# EAGLE design Motor Controller (EAGLE 8.6.0)
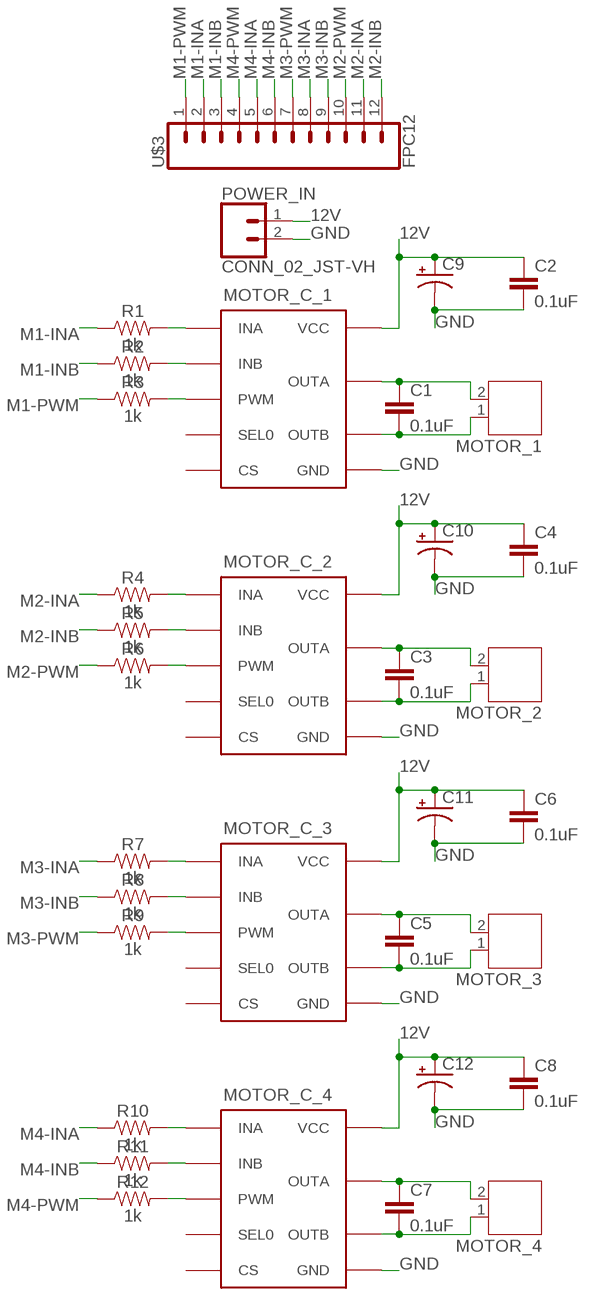
[diagram p0: schematic, sheet 1]

## Parts
C1  0.1uF  0.1UF-0603-25V-(+80/-20%)  [0603]
C2  0.1uF  0.1UF-0603-25V-(+80/-20%)  [0603]
C3  0.1uF  0.1UF-0603-25V-(+80/-20%)  [0603]
C4  0.1uF  0.1UF-0603-25V-(+80/-20%)  [0603]
C5  0.1uF  0.1UF-0603-25V-(+80/-20%)  [0603]
C6  0.1uF  0.1UF-0603-25V-(+80/-20%)  [0603]
C7  0.1uF  0.1UF-0603-25V-(+80/-20%)  [0603]
C8  0.1uF  0.1UF-0603-25V-(+80/-20%)  [0603]
C9  CPOL-USE3.5-8  [E3,5-8]
C10  CPOL-USE3.5-8  [E3,5-8]
C11  CPOL-USE3.5-8  [E3,5-8]
C12  CPOL-USE3.5-8  [E3,5-8]
MOTOR_1  JST-PH2  [JST-PH2]
MOTOR_2  JST-PH2  [JST-PH2]
MOTOR_3  JST-PH2  [JST-PH2]
MOTOR_4  JST-PH2  [JST-PH2]
MOTOR_C_1  VNH7100BASTR  [SO-16]
MOTOR_C_2  VNH7100BASTR  [SO-16]
MOTOR_C_3  VNH7100BASTR  [SO-16]
MOTOR_C_4  VNH7100BASTR  [SO-16]
POWER_IN  CONN_02_JST-VH  [B2P-VH]
R1  1k  1KOHM-0603-1/10W-1%  [0603]
R2  1k  1KOHM-0603-1/10W-1%  [0603]
R3  1k  1KOHM-0603-1/10W-1%  [0603]
R4  1k  1KOHM-0603-1/10W-1%  [0603]
R5  1k  1KOHM-0603-1/10W-1%  [0603]
R6  1k  1KOHM-0603-1/10W-1%  [0603]
R7  1k  1KOHM-0603-1/10W-1%  [0603]
R8  1k  1KOHM-0603-1/10W-1%  [0603]
R9  1k  1KOHM-0603-1/10W-1%  [0603]
R10  1k  1KOHM-0603-1/10W-1%  [0603]
R11  1k  1KOHM-0603-1/10W-1%  [0603]
R12  1k  1KOHM-0603-1/10W-1%  [0603]
U$3  FPC12  [FPC12]

## Nets
12V: C2.1 C4.1 C6.1 C8.1 C9.+ C10.+ C11.+ C12.+ MOTOR_C_1.4(VCC) MOTOR_C_1.5(VCC) MOTOR_C_1.12(VCC) MOTOR_C_2.4(VCC) MOTOR_C_2.5(VCC) MOTOR_C_2.12(VCC) MOTOR_C_3.4(VCC) MOTOR_C_3.5(VCC) MOTOR_C_3.12(VCC) MOTOR_C_4.4(VCC) MOTOR_C_4.5(VCC) MOTOR_C_4.12(VCC) POWER_IN.1
GND: C2.2 C4.2 C6.2 C8.2 C9.- C10.- C11.- C12.- MOTOR_C_1.1(GND) MOTOR_C_1.8(GND) MOTOR_C_1.9(GND) MOTOR_C_1.16(GND) MOTOR_C_2.1(GND) MOTOR_C_2.8(GND) MOTOR_C_2.9(GND) MOTOR_C_2.16(GND) MOTOR_C_3.1(GND) MOTOR_C_3.8(GND) MOTOR_C_3.9(GND) MOTOR_C_3.16(GND) MOTOR_C_4.1(GND) MOTOR_C_4.8(GND) MOTOR_C_4.9(GND) MOTOR_C_4.16(GND) POWER_IN.2
M1-INA: R1.1 U$3.2
M1-INB: R2.1 U$3.3
M1-PWM: R3.1 U$3.1
M2-INA: R4.1 U$3.11
M2-INB: R5.1 U$3.12
M2-PWM: R6.1 U$3.10
M3-INA: R7.1 U$3.8
M3-INB: R8.1 U$3.9
M3-PWM: R9.1 U$3.7
M4-INA: R10.1 U$3.5
M4-INB: R11.1 U$3.6
M4-PWM: R12.1 U$3.4
N$1: MOTOR_C_1.3(INA) R1.2
N$2: MOTOR_C_1.6(INB) R2.2
N$3: MOTOR_C_2.3(INA) R4.2
N$4: MOTOR_C_2.6(INB) R5.2
N$5: MOTOR_C_1.11(PWM) R3.2
N$6: MOTOR_C_2.11(PWM) R6.2
N$7: C3.1 MOTOR_2.2 MOTOR_C_2.2(OUTA) MOTOR_C_2.15(OUTA)
N$8: C1.1 MOTOR_1.2 MOTOR_C_1.2(OUTA) MOTOR_C_1.15(OUTA)
N$9: C1.2 MOTOR_1.1 MOTOR_C_1.7(OUTB) MOTOR_C_1.10(OUTB)
N$10: C3.2 MOTOR_2.1 MOTOR_C_2.7(OUTB) MOTOR_C_2.10(OUTB)
N$11: MOTOR_C_3.3(INA) R7.2
N$12: MOTOR_C_3.6(INB) R8.2
N$13: MOTOR_C_3.11(PWM) R9.2
N$14: C5.1 MOTOR_3.2 MOTOR_C_3.2(OUTA) MOTOR_C_3.15(OUTA)
N$15: C5.2 MOTOR_3.1 MOTOR_C_3.7(OUTB) MOTOR_C_3.10(OUTB)
N$16: MOTOR_C_4.3(INA) R10.2
N$17: MOTOR_C_4.6(INB) R11.2
N$18: MOTOR_C_4.11(PWM) R12.2
N$19: C7.1 MOTOR_4.2 MOTOR_C_4.2(OUTA) MOTOR_C_4.15(OUTA)
N$20: C7.2 MOTOR_4.1 MOTOR_C_4.7(OUTB) MOTOR_C_4.10(OUTB)
Unconnected: MOTOR_C_1.13(CS) MOTOR_C_1.14(SEL0) MOTOR_C_2.13(CS) MOTOR_C_2.14(SEL0) MOTOR_C_3.13(CS) MOTOR_C_3.14(SEL0) MOTOR_C_4.13(CS) MOTOR_C_4.14(SEL0)

## Library data of the parts
C1-C8 = SparkFun-Capacitors:0.1UF: 0.1µF ceramic capacitors A capacitor is a passive two-terminal electrical component used to store electrical energy temporarily in an electric field.; PROD_ID: CAP-00810
C9-C12 = adafruit:CPOL-US: POLARIZED CAPACITOR, American symbol
MOTOR_1-MOTOR_4 = jst-ph:JST-PH2
MOTOR_C_1-MOTOR_C_4 = VNH7100BASTR:VNH7100BASTR: VNH7100BASTR
POWER_IN = JST-VH:CONN_02_JST-VH: B2P-VH(LF)(SN) Digikey <https://www.digikey.com.au/product-detail/en/jst-sales-america-inc/B2P-VH-LF-SN/455-1639-ND/926547>
R1-R12 = SparkFun-Resistors:1KOHM: 1kΩ resistor A resistor is a passive two-terminal electrical component that implements electrical resistance as a circuit element. Resistors act to reduce current flow, and, at the same time, act to lower voltage levels within circuits. - Wikipedia; PROD_ID: RES-07856
U$3 = FFC:FPC12

## Board
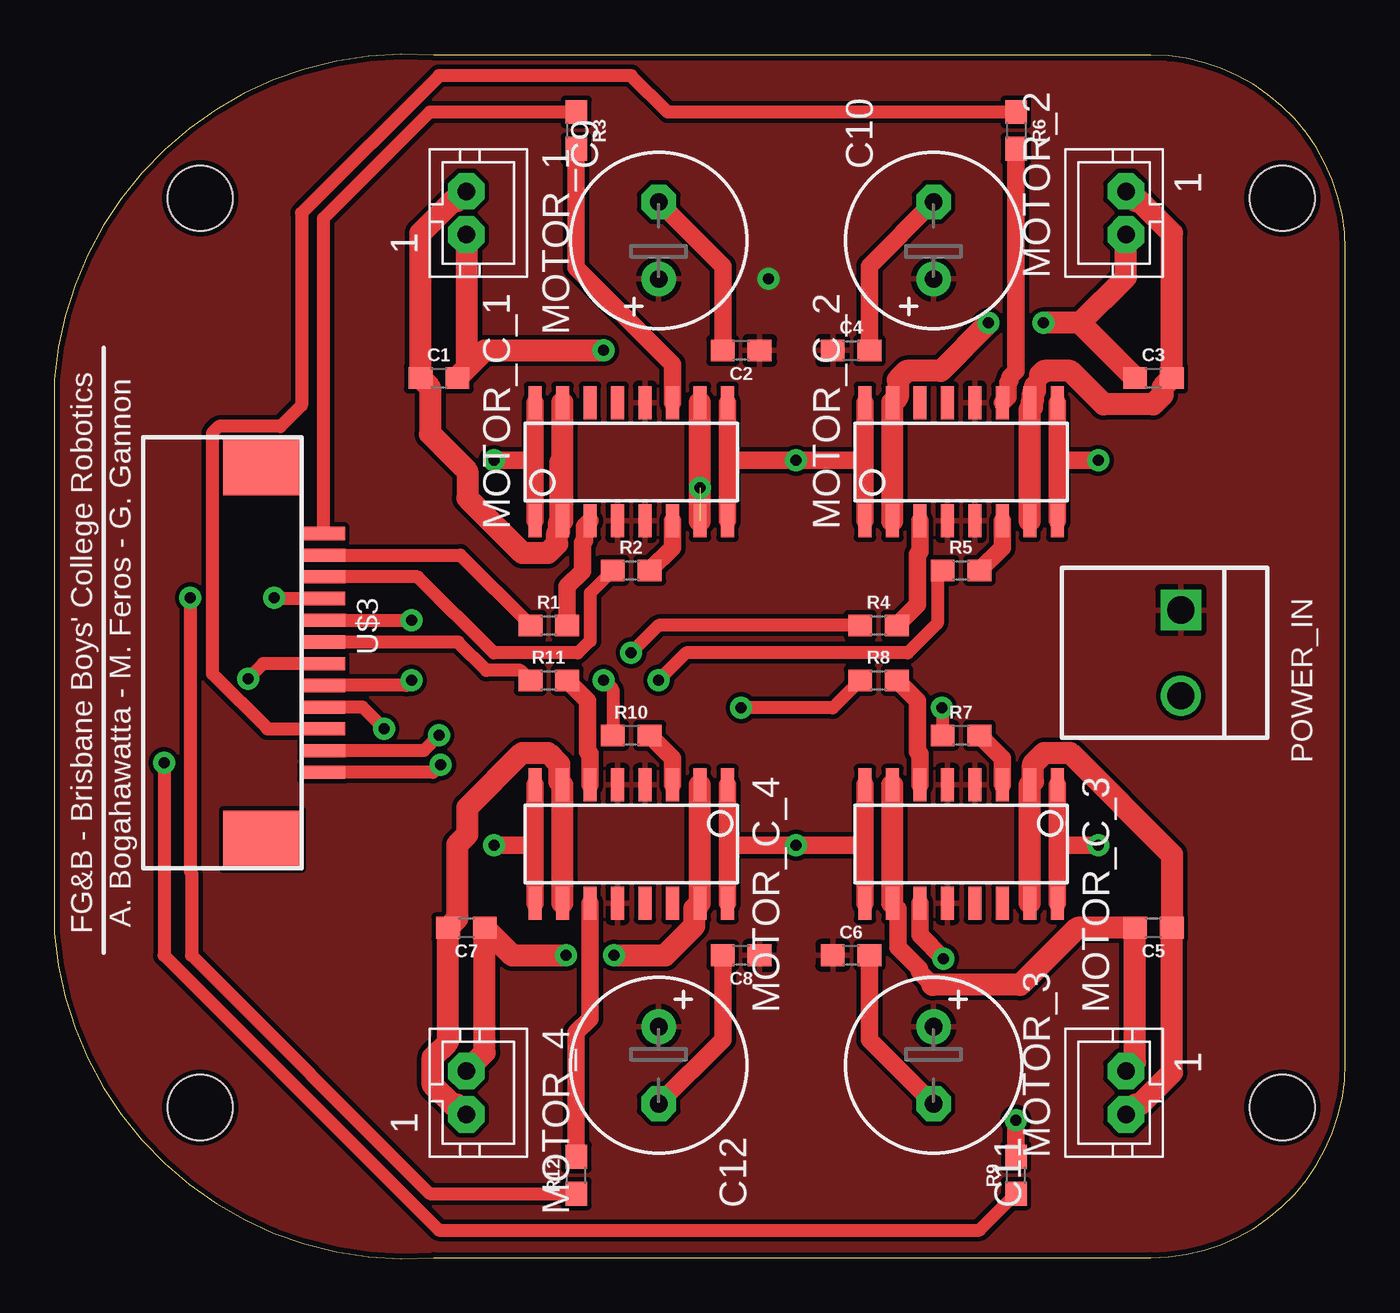
[diagram p1: board, top side]
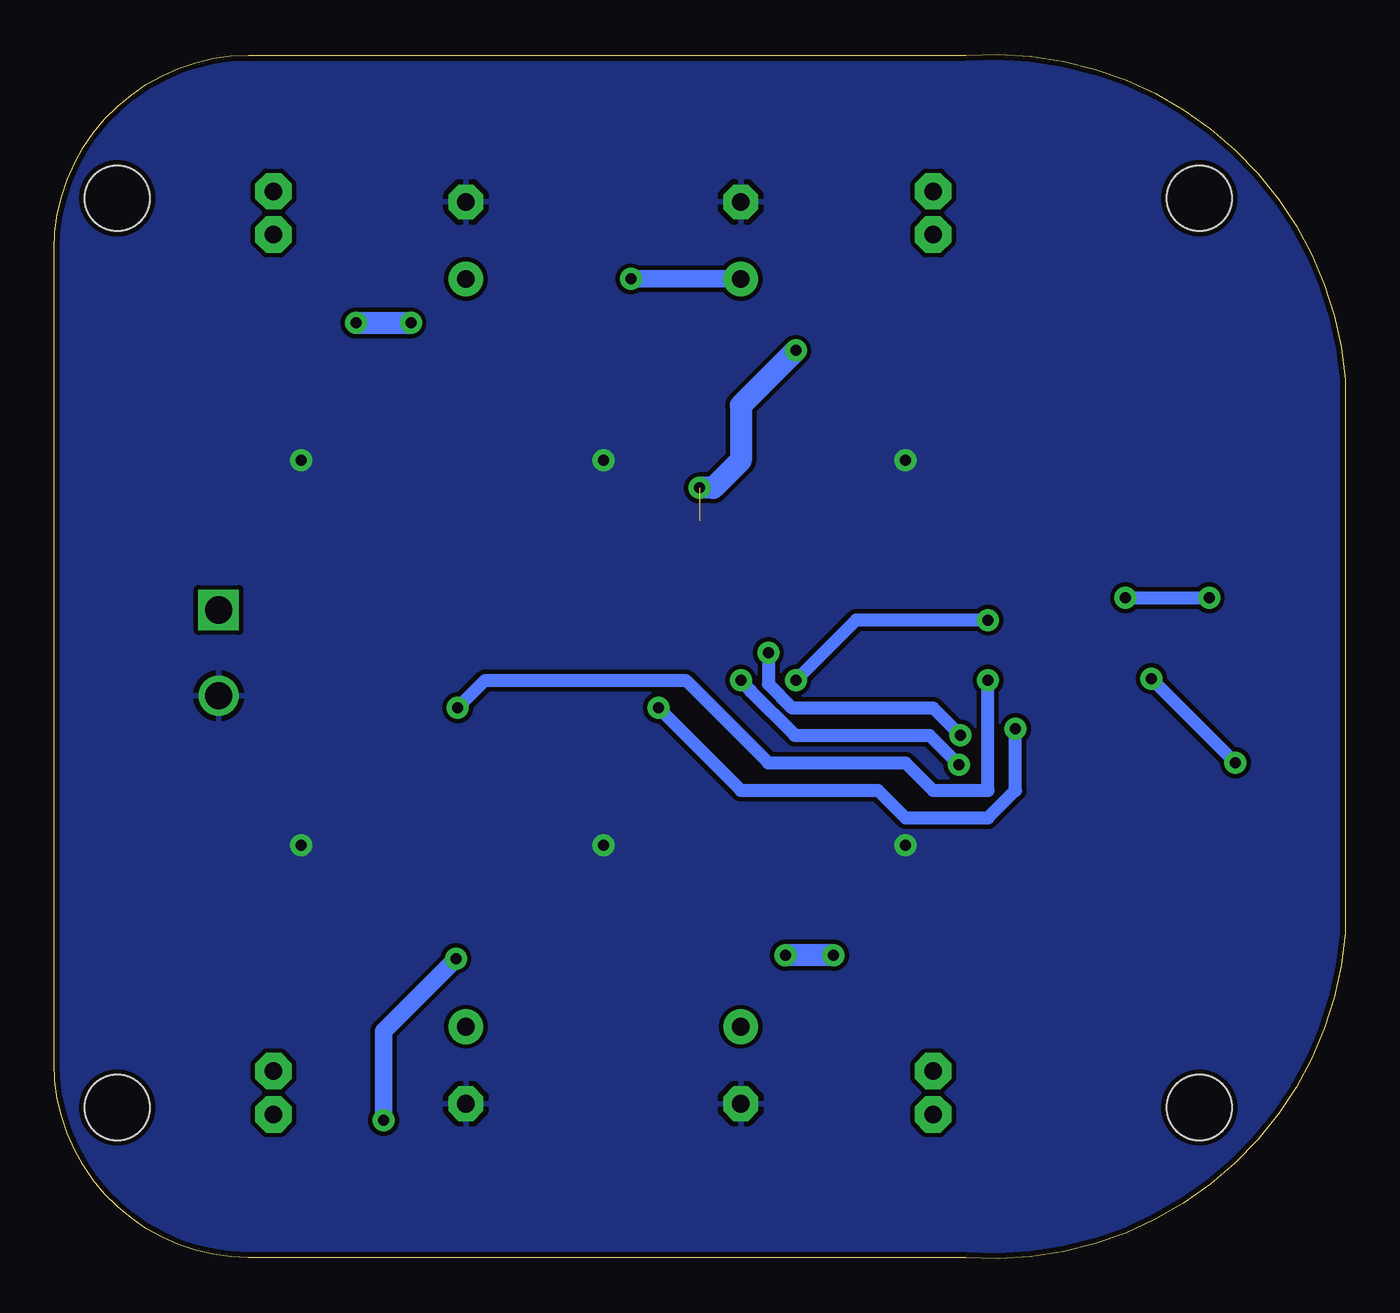
[diagram p2: board, bottom side, seen from below]

Size 59.67 x 55.65 mm. Coordinates in mm from the lower left corner, seen from the top.
Outline: 0,40.6 0,15.05 arc90 17.54,0.05 50.67,0.05 arc90 59.67,9.05 59.67,46.6 arc90 50.67,55.6 17.54,55.6 arc90 0,40.6
Copper layers (1*16): Top 0.035mm / dielectric 1.5mm / Bottom 0.035mm
Design rules "SparkFun": minimum track width 8mil, minimum drill 20mil, track to track 8mil, track to pad 8mil, pad to pad 8mil, via to via 8mil, smd to smd 8mil, copper to edge 10mil, drill to drill 8mil, minimum pad ring 12mil, minimum via ring 10mil, stop-mask expansion 4mil, vias tented up to drill 25mil, thermal gap 10mil
Holes 3 mm at 6.75,6.99 6.75,48.99 56.75,48.99 56.75,6.99

### Footprints (pad centres in the part's own frame; a part is rotated, then mirrored left to right if it is on the bottom)
0603 = smd 1.1 x 1: 1 -0.85,0; 2 0.85,0
E3,5-8 = drill 0.813 pad 1.6: + -1.778,0 | drill 0.813 pad 1.6 octagon: - 1.778,0
JST-PH2 = drill 0.813 pad 1.676 octagon: 1 1,0; 2 -1,0
SO-16 = smd 0.61 x 1.524: 1 -4.445,-2.794; 2 -3.175,-2.794; 3 -1.905,-2.794; 4 -0.635,-2.794; 5 0.635,-2.794; 6 1.905,-2.794; 7 3.175,-2.794; 8 4.445,-2.794; 9 4.445,2.667; 10 3.175,2.667; 11 1.905,2.667; 12 0.635,2.667; 13 -0.635,2.667; 14 -1.905,2.667; 15 -3.175,2.667; 16 -4.445,2.667
B2P-VH = drill 1.25 square: 1 -1.98,0 | drill 1.24: 2 1.98,0
FPC12 = smd 0.61 x 2.007: 1 -5.518,1.003; 2 -4.515,1.003; 3 -3.512,1.003; 4 -2.508,1.003; 5 -1.505,1.003; 6 -0.502,1.003; 7 0.502,1.003; 8 1.505,1.003; 9 2.508,1.003; 10 3.512,1.003; 11 4.515,1.003; 12 5.518,1.003 | smd 2.667 x 3.607: N/C-1 -8.623,-1.803; N/C-2 8.623,-1.803

### Placement (x,y rotation side)
C1  17.78,40.69 0 top
C2  31.75,41.96 180 top
C3  50.8,40.69 0 top
C4  36.83,41.96 0 top
C5  50.8,15.29 180 top
C6  36.83,14.02 0 top
C7  19.05,15.29 180 top
C8  31.75,14.02 180 top
C9  27.94,47.04 90 top
C10  40.64,47.04 90 top
C11  40.64,8.94 270 top
C12  27.94,8.94 270 top
MOTOR_1  19.05,48.31 270 top
MOTOR_2  49.53,48.31 90 top
MOTOR_3  49.53,7.67 90 top
MOTOR_4  19.05,7.67 270 top
MOTOR_C_1  26.67,36.88 0 top
MOTOR_C_2  41.91,36.88 0 top
MOTOR_C_3  41.91,19.1 180 top
MOTOR_C_4  26.67,19.1 180 top
POWER_IN  52.07,27.99 270 top
R1  22.86,29.26 0 top
R2  26.67,31.8 0 top
R3  24.13,52.12 270 top
R4  38.1,29.26 0 top
R5  41.91,31.8 0 top
R6  44.45,52.12 270 top
R7  41.91,24.18 0 top
R8  38.1,26.72 0 top
R9  44.45,3.86 90 top
R10  26.67,24.18 0 top
R11  22.86,26.72 0 top
R12  24.13,3.86 90 top
U$3  11.43,27.99 270 top

### Tracks (layer width: path | path; a pad name or v marks a point on that pad's centre or on a via)
12V  (via drill 0.51)
  Bottom 0.813: C9.+ v33.02,45.26
  pour Top: 57.15,61.01 16.51,61.01 -3.81,49.58 -7.62,11.48 8.89,-5.03 53.34,-5.03 71.12,12.75 71.12,47.04
GND  (via drill 0.51)
  Top 0.813: C4.2 37.68,45.86 C10.- | C2.2 30.9,45.86 C9.- | MOTOR_C_1.1 22.23,36.88 | 22.23,36.88 MOTOR_C_1.16 | MOTOR_C_1.8 31.11,36.88 | 31.11,36.88 MOTOR_C_1.9 | 22.23,36.88 v20.32,36.88 | 31.11,36.88 v34.29,36.88 37.47,36.88 | MOTOR_C_2.1 37.47,36.88 | 37.47,36.88 MOTOR_C_2.16 | MOTOR_C_2.8 46.36,36.88 | 46.36,36.88 MOTOR_C_2.9 | 46.36,36.88 v48.26,36.88 | MOTOR_C_3.1 46.36,19.1 | 46.36,19.1 MOTOR_C_3.16 | MOTOR_C_3.8 37.47,19.1 | 37.47,19.1 MOTOR_C_3.9 | C6.2 37.68,10.12 C11.- | MOTOR_C_4.1 31.11,19.1 | 31.11,19.1 MOTOR_C_4.16 | 31.11,19.1 v34.29,19.1 37.47,19.1 | MOTOR_C_4.8 22.23,19.1 | 22.23,19.1 MOTOR_C_4.9 | C8.2 30.9,10.12 C12.- | 22.23,19.1 v20.32,19.1 | 46.36,19.1 v48.26,19.1
  pour Bottom: 58.42,63.55 16.51,63.55 0,47.04 0,8.94 10.16,-1.22 59.69,-1.22 74.93,14.02 74.93,47.04
M1-INA
  Top 0.61: U$3.2 18.77,32.5 R1.1
M1-INB
  Top 0.61: R2.1 24.77,30.75 24.77,28.55 24.21,27.99 20.32,27.99 16.81,31.5 U$3.3
M1-PWM
  Top 0.61: R3.1 17.36,52.97 12.43,48.04 U$3.1
M2-INA  (via drill 0.51)
  Top 0.61: R4.1 27.94,29.26 v26.67,27.99 | v17.78,24.18 17.07,23.47 U$3.11
  Bottom 0.61: v26.67,27.99 26.67,26.55 25.57,25.45 19.05,25.45 v17.78,24.18
M2-INB  (via drill 0.51)
  Top 0.61: R5.1 40.81,31.55 40.81,29.35 39.45,27.99 29.21,27.99 v27.94,26.72 | v17.86,22.82 17.51,22.47 U$3.12
  Bottom 0.61: v27.94,26.72 27.48,26.26 27.48,26.21 25.45,24.18 19.22,24.18 v17.86,22.82
M2-PWM
  Top 0.61: R6.1 28.36,52.97 26.67,54.66 17.78,54.66 11.43,48.31 11.43,39.42 10.46,38.45 7.61,38.45 7.32,38.15 7.32,27.02 9.86,24.48 U$3.10
M3-INA  (via drill 0.51)
  Top 0.61: R7.1 41.06,25.41 v41.02,25.45 | v16.51,26.72 16.27,26.48 U$3.8
  Bottom 0.61: v41.02,25.45 39.75,26.72 30.48,26.72 26.67,22.91 20.32,22.91 19.05,21.64 16.51,21.64 v16.51,26.72
M3-INB  (via drill 0.51)
  Top 0.61: R8.1 35.98,25.45 v31.75,25.45 | v15.24,24.49 14.25,25.48 U$3.9
  Bottom 0.61: v31.75,25.45 27.94,21.64 21.59,21.64 20.32,20.37 16.51,20.37 15.24,21.64 v15.24,24.49
M3-PWM  (via drill 0.51)
  Top 0.61: U$3.7 9.66,27.49 v8.97,26.8 | v5.08,22.91 5.08,14.02 17.78,1.32 42.76,1.32 R9.1
  Bottom 0.61: v8.97,26.8 v5.08,22.91
M4-INA  (via drill 0.51)
  Top 0.61: U$3.5 12.45,29.51 v16.51,29.51 | v25.4,26.72 25.82,26.3 R10.1
  Bottom 0.61: v16.51,29.51 22.61,29.51 v25.4,26.72
M4-INB
  Top 0.61: R11.1 21.55,27.17 19.98,27.17 18.67,28.49 U$3.6
M4-PWM  (via drill 0.51)
  Top 0.61: U$3.4 10.19,30.5 v10.16,30.53 | v6.3,30.53 6.3,17.88 6.35,17.83 6.35,14.02 17.36,3.01 R12.1
  Bottom 0.61: v10.16,30.53 v6.3,30.53
N$1
  Top 0.813: R1.2 23.71,31.06 24.41,31.76 24.41,33.07 24.51,33.17 24.51,33.83 MOTOR_C_1.3
N$2
  Top 0.813: R2.2 28.57,32.85 MOTOR_C_1.6
N$3
  Top 0.813: MOTOR_C_2.3 40.01,32.65 39.9,32.55 39.9,30.21 R4.2
N$4
  Top 0.813: R5.2 43.81,32.85 MOTOR_C_2.6
N$5
  Top 0.813: R3.2 24.13,45.77 28.57,41.32 MOTOR_C_1.11
N$6
  Top 0.813: MOTOR_C_2.11 44.07,39.8 44.07,40.46 44.17,40.56 44.17,40.73 44.45,41.01 R6.2
N$7  (via drill 0.51)
  Top 1.016: C3.1 47.41,43.23 | 47.41,43.23 v45.72,43.23 | v43.18,43.23 40.97,41.02 39.41,41.02 38.99,40.6 38.99,39.8 MOTOR_C_2.15 MOTOR_C_2.2 | 47.41,43.23 49.53,45.35 MOTOR_2.2
  Bottom 1.016: v45.72,43.23 v43.18,43.23
N$8
  Top 0.813: MOTOR_C_1.15 23.49,36.88 MOTOR_C_1.2
  Top 1.016: MOTOR_1.2 18.6,48.86 18.41,48.86 16.93,47.38 C1.1 17.37,40.25 17.37,38.1 19.1,36.37 19.1,35.14 21.63,32.61 22.82,32.61 23.24,33.03 23.24,33.52 23.34,33.62 23.34,34.03 23.39,34.08 23.39,36.78 23.49,36.88 | MOTOR_C_1.2 MOTOR_C_1.15
N$9  (via drill 0.51)  (1 unrouted)
  Top 1.016: MOTOR_1.1 19.05,41.11 C1.2 19.9,41.96 v25.4,41.96 | MOTOR_C_1.7 MOTOR_C_1.10
  Bottom 1.016: v25.4,41.96 27.94,39.42 27.94,36.88 29.21,35.61 v29.84,35.61
N$10
  Top 0.813: 45.57,40.83 45.57,40.69 45.34,40.46 45.34,40.31 45.34,39.8 MOTOR_C_2.10
  Top 1.016: MOTOR_2.1 49.98,48.86 50.17,48.86 51.65,47.38 C3.2 51.21,40.25 51.21,39.89 50.79,39.47 48.5,39.47 46.95,41.02 45.76,41.02 45.57,40.83 | MOTOR_C_2.7 45.09,39.23 45.19,39.34 45.19,39.65 45.24,39.7 45.24,40.01 45.34,40.11 45.34,40.31
N$11
  Top 0.813: MOTOR_C_3.3 43.81,23.12 R7.2
N$12
  Top 0.813: MOTOR_C_3.6 40.01,23.32 39.9,23.42 39.9,25.77 R8.2
N$13  (via drill 0.51)
  Top 0.813: MOTOR_C_3.11 40.01,14.96 v41.1,13.87 | v44.45,6.4 R9.2
  Bottom 0.813: v41.1,13.87 44.45,10.52 v44.45,6.4
N$14
  Top 1.016: MOTOR_3.2 49.98,7.12 50.17,7.12 51.65,8.6 C5.1 51.65,18.67 46.95,23.36 45.76,23.36 45.24,22.85 45.24,22.04 MOTOR_C_3.2 MOTOR_C_3.15
N$15
  Top 0.813: MOTOR_C_3.10 38.99,16.18 38.99,14.4 39.98,13.4 39.98,13.26 40.57,12.68
  Top 1.016: MOTOR_3.1 49.95,9.09 C5.2 47.28,15.29 44.64,12.65 40.6,12.65 40.57,12.68 | MOTOR_C_3.10 MOTOR_C_3.7
N$16
  Top 0.813: R10.2 28.57,23.12 MOTOR_C_4.3
N$17
  Top 0.813: MOTOR_C_4.6 24.77,23.32 24.66,23.42 24.66,25.77 R11.2
N$18
  Top 0.813: R12.2 24.13,10.46 24.77,11.1 MOTOR_C_4.11
N$19  (via drill 0.51)
  Top 1.016: MOTOR_4.2 19.9,9.52 C7.1 21.17,14.02 v23.65,14.02 | v25.88,14.02 28.23,14.02 29.59,15.37 29.59,16.18 MOTOR_C_4.15 MOTOR_C_4.2
  Bottom 1.016: v23.65,14.02 v25.88,14.02
N$20
  Top 1.016: MOTOR_4.1 18.6,7.12 18.41,7.12 17.5,8.03 17.5,9.31 18.2,10.01 C7.2 18.64,15.73 18.64,19.14 19.1,19.6 19.1,20.84 21.63,23.36 22.82,23.36 23.34,22.85 23.34,22.04 MOTOR_C_4.7 MOTOR_C_4.10

### Text on the board
tPlace: FG&B - Brisbane Boys' College Robotics | A. Bogahawatta - M. Feros - G. Gannon